# Altium schematic sheet ACDC.SchDoc
size A
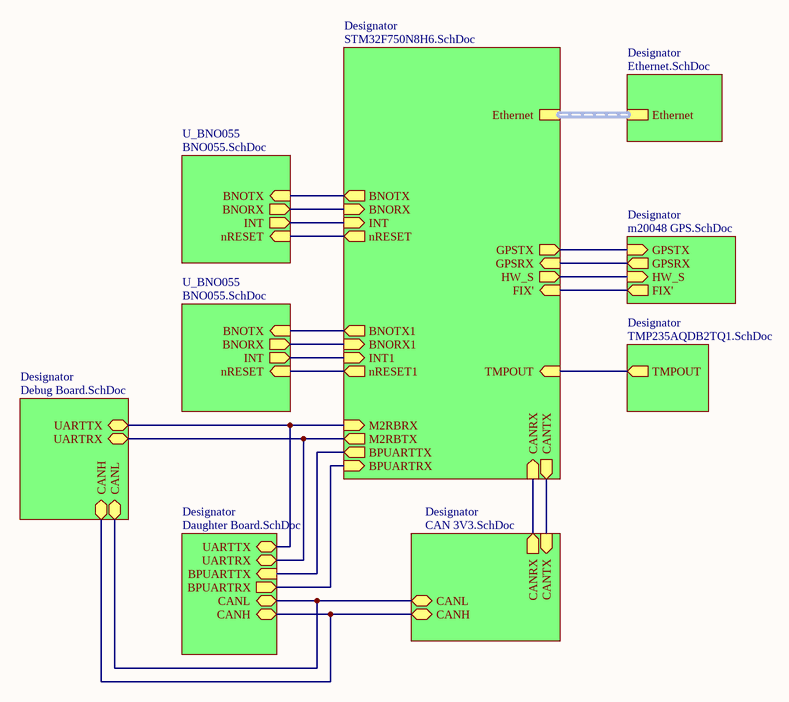
[diagram p0: ACDC.SchDoc]

## Sub-sheets
Designator = Daughter Board.SchDoc: CANH (bidir), UARTTX (bidir), UARTRX (bidir), CANL (bidir), BPUARTTX (in), BPUARTRX (out)
Designator = CAN 3V3.SchDoc: CANL (bidir), CANH (bidir), CANRX (out), CANTX (in)
Designator = m20048 GPS.SchDoc: FIX' (out), HW_S (in), GPSRX (out), GPSTX (in)
Designator = TMP235AQDB2TQ1.SchDoc: TMPOUT (out)
Designator = STM32F750N8H6.SchDoc: INT (in), M2RBRX (in), HW_S (out), INT1 (in), nRESET (out), BNORX (in), GPSTX (out), M2RBTX (out), BNOTX (out), CANTX (out), BNORX1 (in), nRESET1 (out), BNOTX1 (out), TMPOUT (in), GPSRX (in), CANRX (in), FIX' (in), Ethernet (harness MII), BPUARTRX (in), BPUARTTX (out)
Designator = Ethernet.SchDoc: Ethernet (harness MII)
Designator = Debug Board.SchDoc: UARTRX (bidir), CANL (bidir), CANH (bidir), UARTTX (bidir)
U_BNO055 = BNO055.SchDoc: BNORX (out), INT (out), BNOTX (in), nRESET (in)
U_BNO055 = BNO055.SchDoc: BNORX (out), INT (out), BNOTX (in), nRESET (in)

## Nets
(unnamed): sheet Designator/CANH, sheet Designator/CANH, sheet Designator/CANH
(unnamed): sheet Designator/UARTTX, sheet Designator/M2RBRX, sheet Designator/UARTTX
(unnamed): sheet Designator/UARTRX, sheet Designator/M2RBTX, sheet Designator/UARTRX
(unnamed): sheet Designator/CANL, sheet Designator/CANL, sheet Designator/CANL
(unnamed): sheet Designator/BPUARTTX, sheet Designator/BPUARTTX
(unnamed): sheet Designator/BPUARTRX, sheet Designator/BPUARTRX
(unnamed): sheet U_BNO055/BNORX, sheet Designator/BNORX
(unnamed): sheet U_BNO055/INT, sheet Designator/INT
(unnamed): sheet U_BNO055/BNOTX, sheet Designator/BNOTX
(unnamed): sheet U_BNO055/nRESET, sheet Designator/nRESET
(unnamed): sheet Designator/CANRX, sheet Designator/CANRX
(unnamed): sheet Designator/CANTX, sheet Designator/CANTX
(unnamed): sheet Designator/FIX', sheet Designator/FIX'
(unnamed): sheet Designator/HW_S, sheet Designator/HW_S
(unnamed): sheet Designator/GPSRX, sheet Designator/GPSRX
(unnamed): sheet Designator/GPSTX, sheet Designator/GPSTX
(unnamed): sheet U_BNO055/BNORX, sheet Designator/BNORX1
(unnamed): sheet U_BNO055/INT, sheet Designator/INT1
(unnamed): sheet U_BNO055/BNOTX, sheet Designator/BNOTX1
(unnamed): sheet U_BNO055/nRESET, sheet Designator/nRESET1
(unnamed): sheet Designator/TMPOUT, sheet Designator/TMPOUT